# EAGLE board MultiSpork-v1 (EAGLE 6.5.0), part 1 of 2
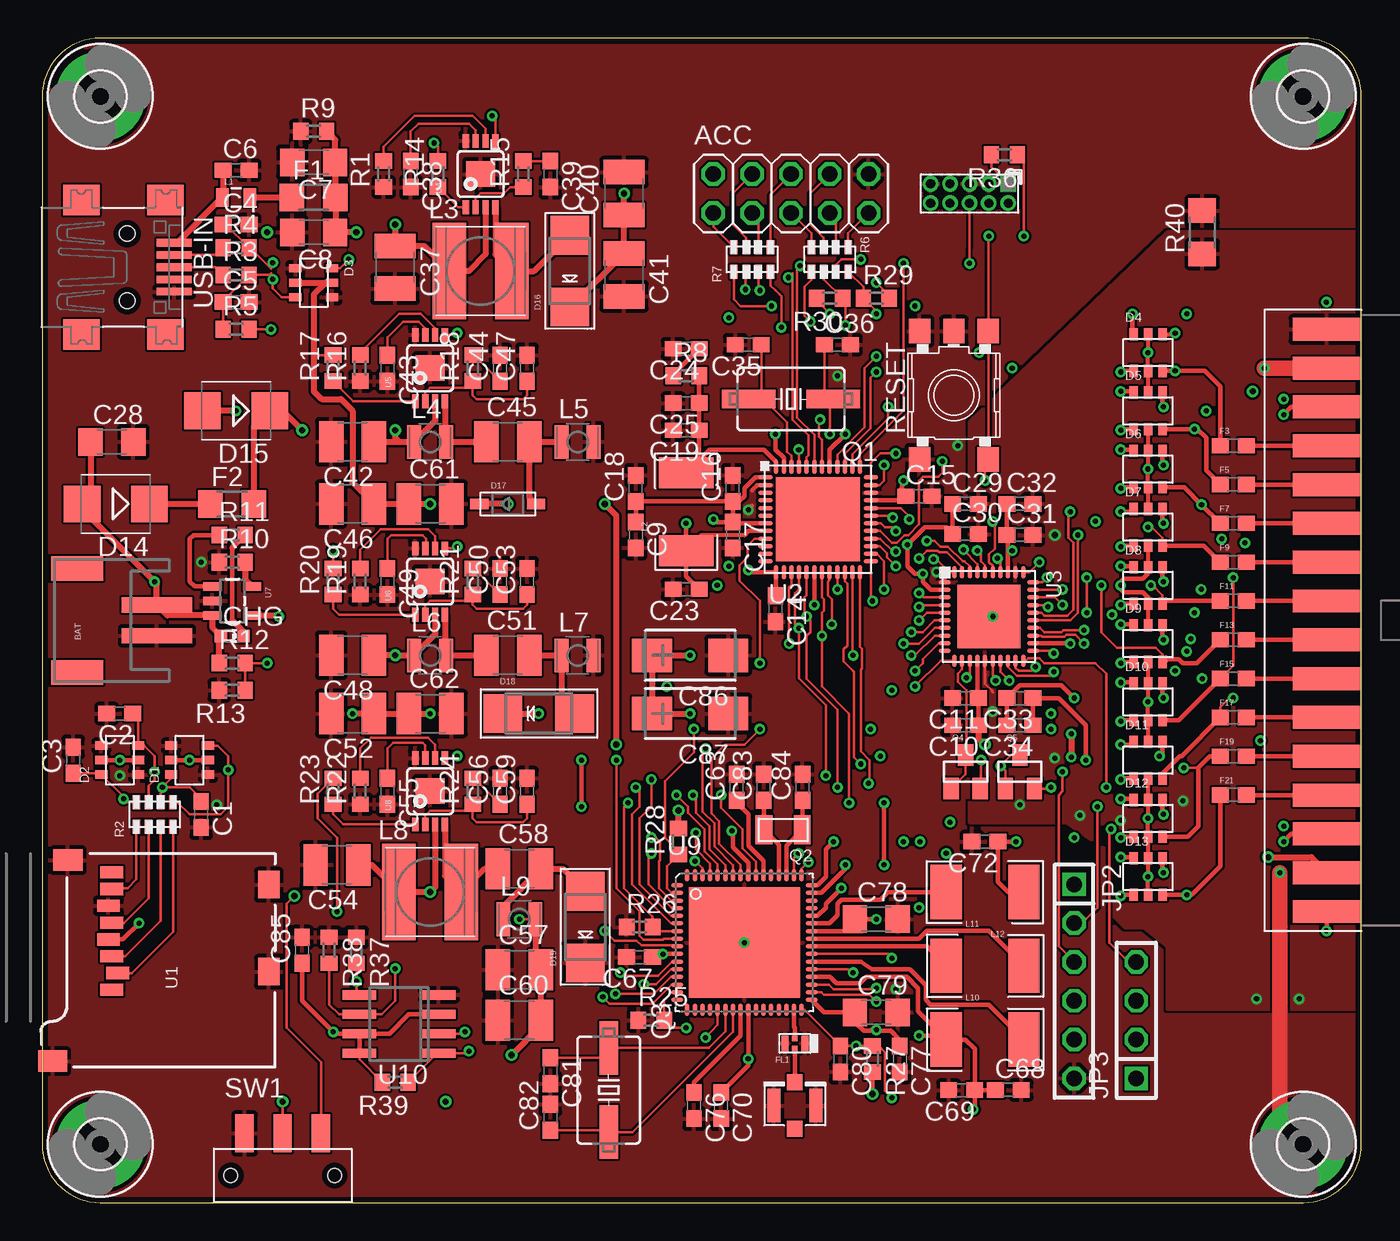
[diagram p6: board, top side]
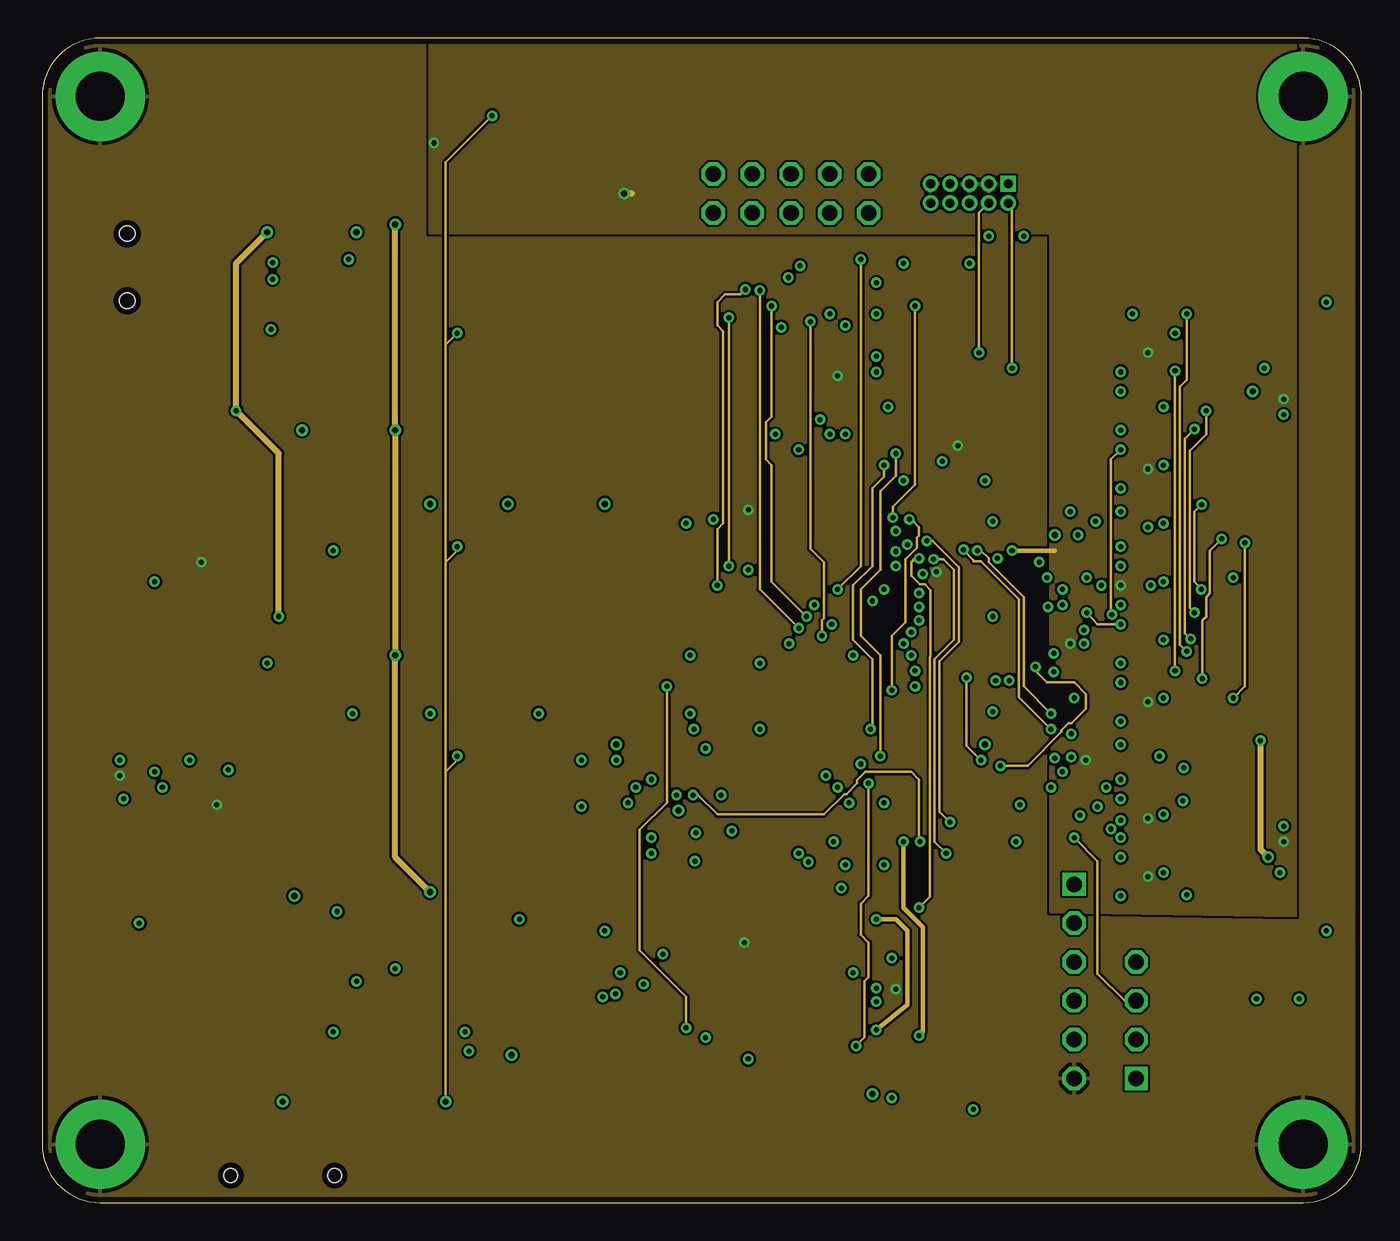
[diagram p7: board, inner layer Route2]
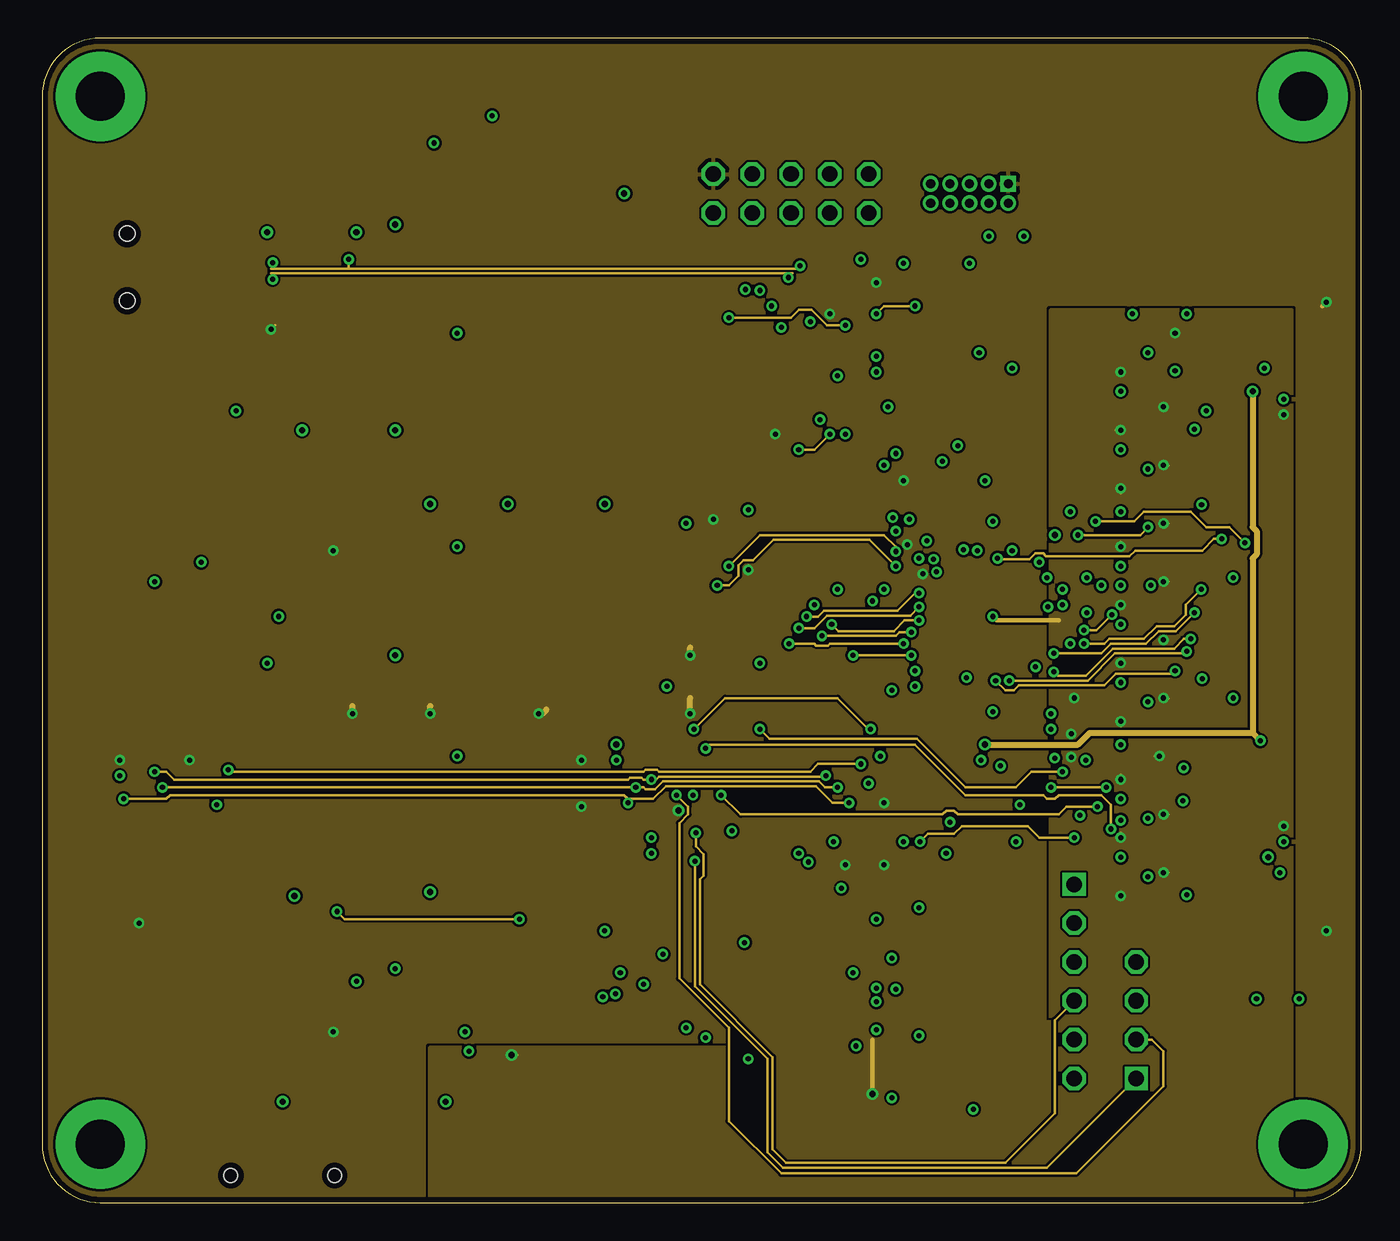
[diagram p8: board, inner layer Route15]
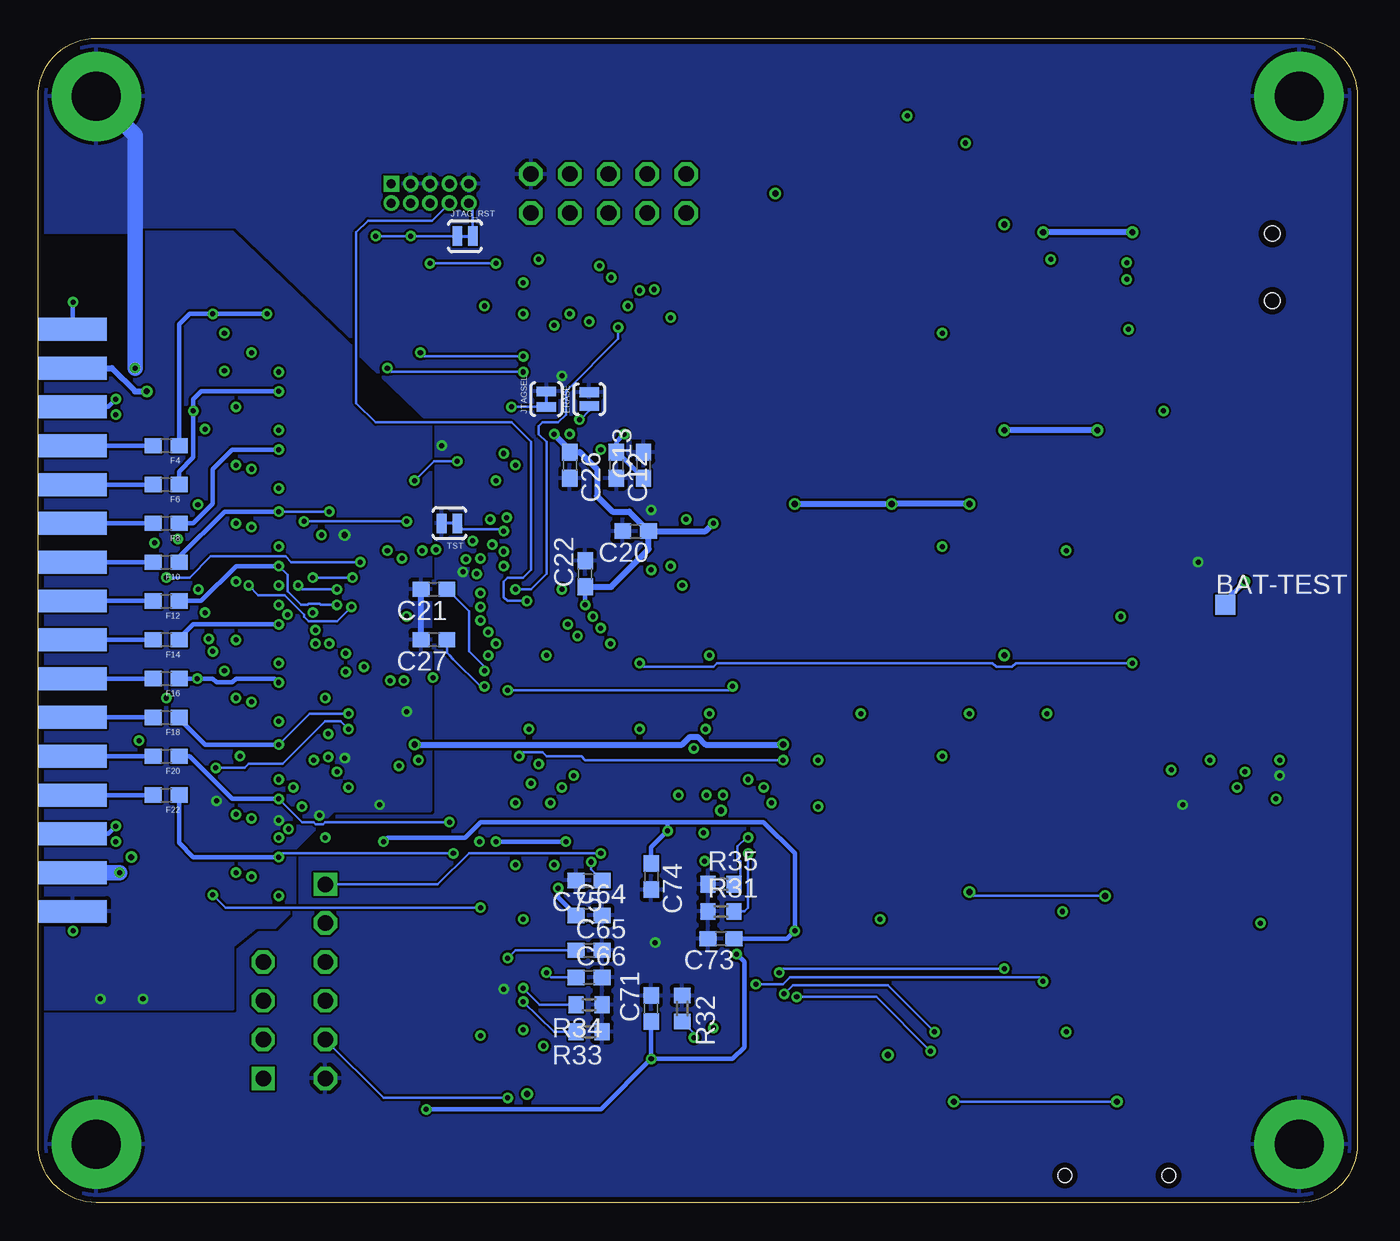
[diagram p9: board, bottom side, seen from below]

Size 86.36 x 76.2 mm. Coordinates in mm from the lower left corner, seen from the top.
Outline: 82.55,76.2 3.81,76.2 arc90 0,72.39 0,3.81 arc90 3.81,0 82.55,0 arc90 86.36,3.81 86.36,72.39 arc90 82.55,76.2
Copper layers (1*2*15*16): Top 0.0356mm / dielectric 1.5011mm / Route2 0.0356mm / dielectric 0.1499mm / Route15 0.0356mm / dielectric 0.2007mm / Bottom 0.0356mm
Design rules "LaenPCBOrder *": minimum track width 6mil, minimum drill 13mil, track to track 6mil, track to pad 6mil, pad to pad 6mil, via to via 6mil, smd to smd 6mil, copper to edge 15mil, drill to drill 6mil, minimum pad ring 7mil, minimum via ring 7mil, stop-mask expansion 4mil, vias tented up to drill 20mil, thermal gap 10mil
Net classes: 2 gnd: width 0.152 mm; 3 usbvcc: width 0.152 mm

## Footprints (pad centres in the part's own frame; a part is rotated, then mirrored left to right if it is on the bottom)
2X05 = drill 1.016 octagon: 1 -5.08,-1.27; 2 -5.08,1.27; 3 -2.54,-1.27; 4 -2.54,1.27; 5 0,-1.27; 6 0,1.27; 7 2.54,-1.27; 8 2.54,1.27; 9 5.08,-1.27; 10 5.08,1.27
32P-SIDE-SMD = smd 4.5 x 1.5: 1 -2.25,19.05; 3 -2.25,16.51; 5 -2.25,13.97; 7 -2.25,11.43; 9 -2.25,8.89; 11 -2.25,6.35; 13 -2.25,3.81; 15 -2.25,1.27; 17 -2.25,-1.27; 19 -2.25,-3.81; 21 -2.25,-6.35; 23 -2.25,-8.89; 25 -2.25,-11.43; 27 -2.25,-13.97; 29 -2.25,-16.51; 31 -2.25,-19.05 | smd 4.5 x 1.5 bottom: 2 -2.25,19.05; 4 -2.25,16.51; 6 -2.25,13.97; 8 -2.25,11.43; 10 -2.25,8.89; 12 -2.25,6.35; 14 -2.25,3.81; 16 -2.25,1.27; 18 -2.25,-1.27; 20 -2.25,-3.81; 22 -2.25,-6.35; 24 -2.25,-8.89; 26 -2.25,-11.43; 28 -2.25,-13.97; 30 -2.25,-16.51; 32 -2.25,-19.05
S2B-PH = smd 1 x 4.6: 1 -1,-3.7; 2 1,-3.7 | smd 1.6 x 3.4: NC1 -3.4,1.5; NC2 3.4,1.5
TP13SQ = smd 1.3 x 1.3: TP 0,0
C0603 = smd 1.1 x 1: 1 -0.85,0; 2 0.85,0
C1206 = smd 1.6 x 1.8: 1 -1.4,0; 2 1.4,0
C1210 = smd 1.6 x 2.7: 1 -1.4,0; 2 1.4,0
CT6032 = smd 2.6 x 2.2: + 2.5,0; - -2.5,0
CHIP-LED0603 = smd 0.8 x 0.8: A 0,-0.75; C 0,0.75
SOT26 = smd 0.55 x 0.8: 1 -0.95,1.2; 2 0,1.2; 3 0.95,1.2; 4 0.95,-1.2; 5 0,-1.2; 6 -0.95,-1.2
SMB = smd 2.4 x 2.4: A 2.2,0; C -2.2,0
SMADIODE = smd 2.54 x 2.54: A 2.349,0; C -2.349,0
SOD-123 = smd 1.2 x 0.7: A 1.85,0; C -1.85,0
PAD-JUMPER-2-NO_YES_SILK = smd 0.635 x 1.27: 1 -0.45,0; 2 0.45,0
R1206 = smd 1.6 x 1.803: 1 -1.422,0; 2 1.422,0
0603 = smd 1.1 x 1: 1 -0.85,0; 2 0.85,0
DEA202450BT = smd 0.35 x 0.35: 1 0,-0.325; 3 0,0.325 | smd 0.45 x 1: 2 0.65,0; 4 -0.65,0
3,2-PAD = drill 3.2 pad 5.842: B3,2 0,0
U.FL = smd 2.2 x 0.85: P$1 0,1.375; P$2 0,-1.375 | smd 1.05 x 1: P$3 1.525,0; P$4 -1.525,0
PINHEAD_2X05_127 = drill 0.6 pad 1.016 square: 1 -0.635,2.54 | drill 0.6 pad 1.016: 2 0.635,2.54; 3 -0.635,1.27; 4 0.635,1.27; 5 -0.635,0; 6 0.635,0; 7 -0.635,-1.27; 8 0.635,-1.27; 9 -0.635,-2.54; 10 0.635,-2.54
1X06 = drill 1.016 square: 1 -6.35,0 | drill 1.016 octagon: 2 -3.81,0; 3 -1.27,0; 4 1.27,0; 5 3.81,0; 6 6.35,0
1X04 = drill 1.016 square: 1 -3.81,0 | drill 1.016 octagon: 2 -1.27,0; 3 1.27,0; 4 3.81,0
PAD-JUMPER-2-NC_BY_TRACE_YES_SILK = smd 0.635 x 1.27: 1 -0.508,0; 2 0.508,0
0805 = smd 0.8 x 1.2: 1 -0.9,0; 2 0.9,0
INDUCTOR-1206 = smd 2.032 x 3.556: P$1 -2.54,0; P$2 2.54,0
L2323 = smd 2.2 x 6.3: 3 -2.05,0; 4 2.05,0
L1008 = smd 0.9 x 2.2: 1 -1.05,0; 2 1.05,0
CSM-3X = smd 3.5 x 1.2: 1 -2.75,0; 2 2.75,0
ECX-31B = smd 1.1 x 1.9: 1 -1.25,0; 2 1.25,0
SOT23 = smd 1 x 1.4: 1 -0.95,-1.1; 2 0.95,-1.1; 3 0,1.1
R0603 = smd 1 x 1.1: 1 -0.85,0; 2 0.85,0
CTS742C083-RES = smd 0.9 x 0.5: 1 -0.8,1.2; 2 0.8,1.2; 3 -0.8,0.4; 4 0.8,0.4; 5 -0.8,-0.4; 6 0.8,-0.4; 7 -0.8,-1.2; 8 0.8,-1.2
SKHMPXE010 = smd 1.6 x 1.4: 1 -4.2,2.25; 2 4.2,2.25; 3 -4.2,-2.25; 4 4.2,-2.25; 5 4.2,0
JS102011SAQN = smd 1.2 x 2.5: 1 -2.5,2.75; 2 0,2.75; 3 2.5,2.75 | hole 0.9: -3.4,0; 3.4,0
MICRO-SD-SOCKET-PP = smd 0.8 x 1.5: 1 -8.94,10.7; 2 -7.84,10.3; 3 -6.74,10.7; 4 -5.64,10.9; 5 -4.54,10.7; 6 -3.44,10.9; 7 -2.34,10.7; 8 -1.24,10.7 | smd 1.8 x 1.4: CD1 -2.05,0.4; CD2 -7.75,0.4 | smd 1.4 x 1.9: GND1 -13.6,14.55; GND3 -0.45,13.55
QFN48 = smd 0.95 x 0.3: 1 -3.45,2.75; 2 -3.45,2.25; 3 -3.45,1.75; 4 -3.45,1.25; 5 -3.45,0.75; 6 -3.45,0.25; 7 -3.45,-0.25; 8 -3.45,-0.75; 9 -3.45,-1.25; 10 -3.45,-1.75; 11 -3.45,-2.25; 12 -3.45,-2.75; 25 3.45,-2.75; 26 3.45,-2.25; 27 3.45,-1.75; 28 3.45,-1.25; 29 3.45,-0.75; 30 3.45,-0.25; 31 3.45,0.25; 32 3.45,0.75; 33 3.45,1.25; 34 3.45,1.75; 35 3.45,2.25; 36 3.45,2.75 | smd 0.3 x 0.95: 13 -2.75,-3.45; 14 -2.25,-3.45; 15 -1.75,-3.45; 16 -1.25,-3.45; 17 -0.75,-3.45; 18 -0.25,-3.45; 19 0.25,-3.45; 20 0.75,-3.45; 21 1.25,-3.45; 22 1.75,-3.45; 23 2.25,-3.45; 24 2.75,-3.45; 37 2.75,3.45; 38 2.25,3.45; 39 1.75,3.45; 40 1.25,3.45; 41 0.75,3.45; 42 0.25,3.45; 43 -0.25,3.45; 44 -0.75,3.45; 45 -1.25,3.45; 46 -1.75,3.45; 47 -2.25,3.45; 48 -2.75,3.45 | smd 5.5 x 5.5: GND_PAD 0,0
TQFN40 = smd 0.3 x 0.8: 1 -2.25,-2.9; 2 -1.75,-2.9; 3 -1.25,-2.9; 4 -0.75,-2.9; 5 -0.25,-2.9; 6 0.25,-2.9; 7 0.75,-2.9; 8 1.25,-2.9; 9 1.75,-2.9; 10 2.25,-2.9; 21 2.25,2.9; 22 1.75,2.9; 23 1.25,2.9; 24 0.75,2.9; 25 0.25,2.9; 26 -0.25,2.9; 27 -0.75,2.9; 28 -1.25,2.9; 29 -1.75,2.9; 30 -2.25,2.9 | smd 0.8 x 0.3: 11 2.9,-2.25; 12 2.9,-1.75; 13 2.9,-1.25; 14 2.9,-0.75; 15 2.9,-0.25; 16 2.9,0.25; 17 2.9,0.75; 18 2.9,1.25; 19 2.9,1.75; 20 2.9,2.25; 31 -2.9,2.25; 32 -2.9,1.75; 33 -2.9,1.25; 34 -2.9,0.75; 35 -2.9,0.25; 36 -2.9,-0.25; 37 -2.9,-0.75; 38 -2.9,-1.25; 39 -2.9,-1.75; 40 -2.9,-2.25 | smd 4.13 x 4.13: EP 0,0
MSOP8 = smd 0.42 x 0.89: 1 -0.975,-2.17; 2 -0.325,-2.17; 3 0.325,-2.17; 4 0.975,-2.17; 5 0.975,2.17; 6 0.325,2.17; 7 -0.325,2.17; 8 -0.975,2.17 | smd 1.88 x 1.68: EP 0,0
SOT23-5 = smd 0.55 x 1.2: 1 -0.95,-1.3; 2 0,-1.3; 3 0.95,-1.3; 4 0.95,1.3; 5 -0.95,1.3
QFN64 = smd 0.8 x 0.3: 1 -4.4,3.75; 2 -4.4,3.25; 3 -4.4,2.75; 4 -4.4,2.25; 5 -4.4,1.75; 6 -4.4,1.25; 7 -4.4,0.75; 8 -4.4,0.25; 9 -4.4,-0.25; 10 -4.4,-0.75; 11 -4.4,-1.25; 12 -4.4,-1.75; 13 -4.4,-2.25; 14 -4.4,-2.75; 15 -4.4,-3.25; 16 -4.4,-3.75; 33 4.4,-3.75; 34 4.4,-3.25; 35 4.4,-2.75; 36 4.4,-2.25; 37 4.4,-1.75; 38 4.4,-1.25; 39 4.4,-0.75; 40 4.4,-0.25; 41 4.4,0.25; 42 4.4,0.75; 43 4.4,1.25; 44 4.4,1.75; 45 4.4,2.25; 46 4.4,2.75; 47 4.4,3.25; 48 4.4,3.75 | smd 0.3 x 0.8: 17 -3.75,-4.4; 18 -3.25,-4.4; 19 -2.75,-4.4; 20 -2.25,-4.4; 21 -1.75,-4.4; 22 -1.25,-4.4; 23 -0.75,-4.4; 24 -0.25,-4.4; 25 0.25,-4.4; 26 0.75,-4.4; 27 1.25,-4.4; 28 1.75,-4.4; 29 2.25,-4.4; 30 2.75,-4.4; 31 3.25,-4.4; 32 3.75,-4.4; 49 3.75,4.4; 50 3.25,4.4; 51 2.75,4.4; 52 2.25,4.4; 53 1.75,4.4; 54 1.25,4.4; 55 0.75,4.4; 56 0.25,4.4; 57 -0.25,4.4; 58 -0.75,4.4; 59 -1.25,4.4; 60 -1.75,4.4; 61 -2.25,4.4; 62 -2.75,4.4; 63 -3.25,4.4; 64 -3.75,4.4 | smd 7.25 x 7.25: PAD 0,0
SOIC8 = smd 0.6 x 2.2: 1 -1.905,-2.6; 2 -0.635,-2.6; 3 0.635,-2.6; 4 1.905,-2.6; 5 1.905,2.6; 6 0.635,2.6; 7 -0.635,2.6; 8 -1.905,2.6
USB-MINIB = smd 0.5 x 2.308: D+ 0,4.064; D- -0.8,4.064; GND 1.6,4.064; ID 0.8,4.064; VBUS -1.6,4.064 | smd 2 x 2.4: GND1 -4.4,-2; GND2 -4.4,3.5; GND3 4.4,3.5; GND4 4.4,-2 | hole 1: -2.2,1; 2.2,1

## Placement (x,y rotation side)
ACC  [2X05]  49.02,66.04 0 top
ANALOG  76385-316LF  [32P-SIDE-SMD]  86.36,38.1 0 top
BAT  [S2B-PH]  3.81,38.1 90 top
BAT-TEST  PTR1TP13SQ  [TP13SQ]  8.64,39.12 0 bottom
C1  33p  [C0603]  10.41,25.4 270 top
C2  33p  [C0603]  5.08,32 180 top
C3  33p  [C0603]  2.03,28.96 90 top
C4  33p  [C0603]  12.7,64.01 0 top
C5  33p  [C0603]  12.7,58.93 0 top
C6  10n  [C0603]  12.7,67.56 0 top
C7  10u  [C1206]  17.78,68.07 180 top
C8  10u  [C1206]  17.78,63.5 180 top
C9  100n  [C0603]  38.86,43.69 270 top
C10  100n  [C0603]  60.45,31.24 180 top
C11  1u  [C0603]  60.45,33.02 180 top
C12  100n  [C0603]  48.51,48.26 270 bottom
C13  100n  [C0603]  46.74,48.26 90 bottom
C14  100n  [C0603]  48.01,38.86 270 top
C15  100n  [C0603]  57.4,46.23 0 top
C16  4u7  [C0603]  45.21,46.74 90 top
C17  4u7  [C0603]  45.21,43.69 270 top
C18  10u  [C0603]  38.86,46.74 90 top
C19  100n  [C0603]  42.16,50.55 180 top
C20  100n  [C0603]  47.24,43.94 180 bottom
C21  4u7  [C0603]  60.45,40.13 180 bottom
C22  100n  [C0603]  50.55,41.15 90 bottom
C23  2u2  [C0603]  42.16,40.13 180 top
C24  4u7  [C0603]  42.16,55.88 180 top
C25  100n  [C0603]  42.16,52.32 180 top
C26  100n  [C0603]  51.56,48.26 270 bottom
C27  4u7  [C0603]  60.45,36.83 180 bottom
C28  4u7  [C1206]  4.57,49.78 0 top
C29  100n  [C0603]  60.45,45.72 0 top
C30  1u  [C0603]  60.45,43.75 0 top
C31  100n  [C0603]  64.01,43.69 0 top
C32  1u  [C0603]  64.01,45.72 0 top
C33  100n  [C0603]  64.01,33.02 180 top
C34  1u  [C0603]  64.01,31.24 180 top
C35  33p  [C0603]  46.23,56.13 180 top
C36  33p  [C0603]  52.07,56.13 0 top
C37  4u7  [C1210]  23.11,61.21 270 top
C38  100n  [C0603]  24.13,67.31 270 top
C39  2n2  [C0603]  33.27,67.31 270 top
C40  10u  [C1210]  38.1,66.04 90 top
C41  10u  [C1210]  38.1,60.71 270 top
C42  4u7  [C1210]  20.32,49.78 180 top
C43  100n  [C0603]  22.61,54.61 270 top
C44  1n  [C0603]  29.97,54.61 90 top
C45  1u  [C1210]  30.48,49.78 0 top
C46  10u  [C1210]  20.32,45.72 180 top
C47  22p  [C0603]  31.75,54.61 90 top
C48  4u7  [C1210]  20.32,35.81 180 top
C49  100n  [C0603]  22.61,40.64 270 top
C50  1n  [C0603]  29.97,40.64 90 top
C51  1u  [C1210]  30.48,35.81 0 top
C52  10u  [C1210]  20.32,32 180 top
C53  22p  [C0603]  31.75,40.64 90 top
C54  4u7  [C1210]  19.3,22.1 180 top
C55  100n  [C0603]  22.61,26.92 270 top
C56  2n2  [C0603]  29.97,26.92 90 top
C57  10u  [C1210]  31.24,15.24 0 top
C58  1u  [C1210]  31.24,21.84 0 top
C59  DNP  [C0603]  31.75,26.92 90 top
C60  10u  [C1210]  31.24,11.94 0 top
C61  10u  [C1210]  25.4,45.72 0 top
C62  10u  [C1210]  25.4,32 0 top
C63  100n  [C0603]  45.47,27.18 90 top
C64  4u7  [C0603]  50.29,18.8 0 bottom
C65  4u7  [C0603]  50.29,16.51 0 bottom
C66  4u7  [C0603]  50.29,14.73 0 bottom
C67  100n  [C0603]  39.12,16.07 180 top
C68  10u  [C0603]  63.25,7.37 0 top
C69  100n  [C0603]  60.2,7.37 180 top
C70  100n  [C0603]  44.45,6.35 270 top
C71  100n  [C0603]  46.23,12.7 90 bottom
C72  10u  [C0603]  61.72,23.62 180 top
C73  100n  [C0603]  41.66,17.27 180 bottom
C74  100n  [C0603]  46.23,21.34 270 bottom
C75  100n  [C0603]  50.29,21.08 180 bottom
C76  100n  [C0603]  42.67,6.35 270 top
C77  100n  [C0603]  56.13,9.4 270 top
C78  22u  [C1206]  54.61,18.54 0 top
C79  22u  [C1206]  54.61,12.45 0 top
C80  100n  [C0603]  52.26,9.4 270 top
C81  33p  [C0603]  33.27,8.64 270 top
C82  33p  [C0603]  33.27,5.59 90 top
C83  15p  [C0603]  47.24,27.18 90 top
C84  15p  [C0603]  49.78,27.18 90 top
C85  100n  [C0603]  17.02,16.51 90 top
C86  100u  [CT6032]  42.42,35.81 180 top
C87  100u  [CT6032]  42.42,32 180 top
CHG  RED  [CHIP-LED0603]  12.45,37.08 270 top
D1  SD103ASDM  [SOT26]  9.65,28.96 90 top
D2  SD103ASDM  [SOT26]  5.08,28.96 90 top
D3  SD103ASDM  [SOT26]  17.78,60.2 270 top
D4  SD103ASDM  [SOT26]  72.39,55.63 0 top
D5  SD103ASDM  [SOT26]  72.39,51.82 0 top
D6  SD103ASDM  [SOT26]  72.39,48.01 0 top
D7  SD103ASDM  [SOT26]  72.39,44.2 0 top
D8  SD103ASDM  [SOT26]  72.39,40.39 0 top
D9  SD103ASDM  [SOT26]  72.39,36.58 0 top
D10  SD103ASDM  [SOT26]  72.39,32.77 0 top
D11  SD103ASDM  [SOT26]  72.39,28.96 0 top
D12  SD103ASDM  [SOT26]  72.39,25.15 0 top
D13  SD103ASDM  [SOT26]  72.39,21.34 0 top
D14  [SMB]  4.83,45.72 180 top
D15  [SMB]  12.7,51.82 180 top
D16  2A/40V  [SMADIODE]  34.54,60.96 90 top
D17  [SOD-123]  30.48,45.72 0 top
D18  2A/40V  [SMADIODE]  32.51,32 0 top
D19  2A/40V  [SMADIODE]  35.56,18.03 90 top
ERASE  [PAD-JUMPER-2-NO_YES_SILK]  50.29,52.58 90 bottom
F1  500 mA  [R1206]  17.78,65.79 0 top
F2  1000 mA  [R1206]  12.45,45.72 0 top
F3  [0603]  77.98,49.53 0 top
F4  [0603]  77.98,49.53 180 bottom
F5  [0603]  77.98,46.99 0 top
F6  [0603]  77.98,46.99 180 bottom
F7  [0603]  77.98,44.45 0 top
F8  [0603]  77.98,44.45 180 bottom
F9  [0603]  77.98,41.91 0 top
F10  [0603]  77.98,41.91 180 bottom
F11  [0603]  77.98,39.37 0 top
F12  [0603]  77.98,39.37 180 bottom
F13  [0603]  77.98,36.83 0 top
F14  [0603]  77.98,36.83 180 bottom
F15  [0603]  77.98,34.29 0 top
F16  [0603]  77.98,34.29 180 bottom
F17  [0603]  77.98,31.75 0 top
F18  [0603]  77.98,31.75 180 bottom
F19  [0603]  77.98,29.21 0 top
F20  [0603]  77.98,29.21 180 bottom
F21  [0603]  77.98,26.67 0 top
F22  [0603]  77.98,26.67 180 bottom
FL1  DEA202450BT  [DEA202450BT]  49.28,10.41 180 top
H1  MOUNT-PAD-ROUND3.2  [3,2-PAD]  82.55,72.39 0 top
H2  MOUNT-PAD-ROUND3.2  [3,2-PAD]  82.55,3.81 0 top
H3  MOUNT-PAD-ROUND3.2  [3,2-PAD]  3.81,3.81 0 top
H4  MOUNT-PAD-ROUND3.2  [3,2-PAD]  3.81,72.39 0 top
J1  U.FL  [U.FL]  49.28,6.35 90 top
JP1  [PINHEAD_2X05_127]  60.71,66.04 270 top
JP2  [1X06]  67.56,14.48 270 top
JP3  [1X04]  71.63,11.94 90 top
JTAG_RST  [PAD-JUMPER-2-NC_BY_TRACE_YES_SILK]  58.42,63.25 0 bottom
JTAGSEL  [PAD-JUMPER-2-NC_BY_TRACE_YES_SILK]  53.09,52.58 90 bottom
L1  ferrite  [0805]  12.7,65.79 0 top
L2  10u  [INDUCTOR-1206]  42.16,45.21 90 top
L3  3u9  [L2323]  28.7,60.96 0 top
L4  2u2  [L1008]  25.4,49.78 0 top
L5  2u2  [L1008]  35.05,49.78 0 top
L6  2u2  [L1008]  25.4,35.81 0 top
L7  2u2  [L1008]  35.05,35.81 0 top
L8  5u3  [L2323]  25.4,20.32 0 top
L9  5u6  [L1008]  31.24,18.54 0 top
L10  2u2  [INDUCTOR-1206]  61.72,10.67 0 top
L11  1u  [INDUCTOR-1206]  61.72,15.49 0 top
L12  2u2  [INDUCTOR-1206]  61.72,20.32 180 top
Q1  20 MHz  [CSM-3X]  49.02,52.58 180 top
Q2  32.768 kHz  [ECX-31B]  48.51,24.38 0 top
Q3  40 MHz  [CSM-3X]  37.08,7.37 270 top
Q4  MMBT3904  [SOT23]  60.45,28.19 0 top
Q5  MMBT3904  [SOT23]  64.01,28.19 0 top
R1  47K  [R0603]  22.35,67.31 90 top
R2  100R  [CTS742C083-RES]  7.37,25.4 90 top
R3  27R  [R0603]  12.7,60.71 0 top
R4  27R  [R0603]  12.7,62.48 0 top
R5  1K5  [R0603]  12.7,57.15 0 top
R6  100R  [CTS742C083-RES]  51.56,61.72 270 top
R7  100R  [CTS742C083-RES]  46.48,61.72 90 top
R8  1R  [R0603]  42.16,54.1 0 top
R9  10K  [R0603]  17.78,70.1 0 top
R10  2K  [R0603]  12.45,41.91 0 top
R11  1K  [R0603]  12.45,43.69 0 top
R12  1M2  [R0603]  12.45,35.31 0 top
R13  1M  [R0603]  12.45,33.53 180 top
R14  105K  [R0603]  25.91,67.31 90 top
R15  10K  [R0603]  31.5,67.31 90 top
R16  47K  [R0603]  20.83,54.61 90 top
R17  45K3  [R0603]  19.05,54.61 90 top
R18  10K  [R0603]  28.19,54.61 90 top
R19  47K  [R0603]  20.83,40.64 90 top
R20  24K  [R0603]  19.05,40.64 90 top
R21  10K  [R0603]  28.19,40.64 90 top
R22  47K  [R0603]  20.83,26.92 90 top
R23  120K  [R0603]  19.05,26.92 90 top
R24  10K  [R0603]  28.19,26.92 90 top
R25  10K  [R0603]  39.88,11.94 0 top
R26  100K  [R0603]  39.12,18.03 0 top
R27  100K  [R0603]  54.36,9.4 270 top
R28  100K  [R0603]  41.66,23.62 90 top
R29  4K7  [R0603]  54.61,59.18 0 top
R30  4K7  [R0603]  51.56,59.18 180 top
R31  100K  [R0603]  41.66,19.05 0 bottom
R32  10K  [R0603]  44.2,12.7 270 bottom
R33  100K  [R0603]  50.29,11.18 180 bottom
R34  100K  [R0603]  50.29,12.95 180 bottom
R35  100K  [R0603]  41.66,20.83 0 bottom
R36  10K  [R0603]  62.99,68.58 180 top
R37  100K  [R0603]  20.57,16.51 270 top
R38  100K  [R0603]  18.8,16.51 270 top
R39  100K  [R0603]  23.11,7.87 180 top
R40  1R  [R1206]  75.95,63.5 90 top
RESET  SKHMPSE010  [SKHMPXE010]  59.69,52.83 90 top
SW1  JS102011SAQN  [JS102011SAQN]  15.75,1.78 0 top
TST  [PAD-JUMPER-2-NC_BY_TRACE_YES_SILK]  59.44,44.45 180 bottom
U1  USD-SOCKETNEW  [MICRO-SD-SOCKET-PP]  15.24,22.86 90 top
U2  SAM3SA-MU  [QFN48]  50.8,44.7 0 top
U3  MAX11300GTL  [TQFN40]  61.98,38.35 270 top
U4  LT3580EMS8E  [MSOP8]  28.7,67.31 0 top
U5  LT3580EMS8E  [MSOP8]  25.4,54.61 0 top
U6  LT3580EMS8E  [MSOP8]  25.4,40.64 0 top
U7  MCP73831  [SOT23-5]  12.45,39.37 270 top
U8  LT3580EMS8E  [MSOP8]  25.4,26.92 0 top
U9  CC3100  [QFN64]  45.97,17.02 0 top
U10  M25PX80  [SOIC8]  23.37,11.68 90 top
USB-IN  [USB-MINIB]  4.57,61.21 270 top